# Altium schematic sheet WX0.011.324DL.SchDoc
size A3
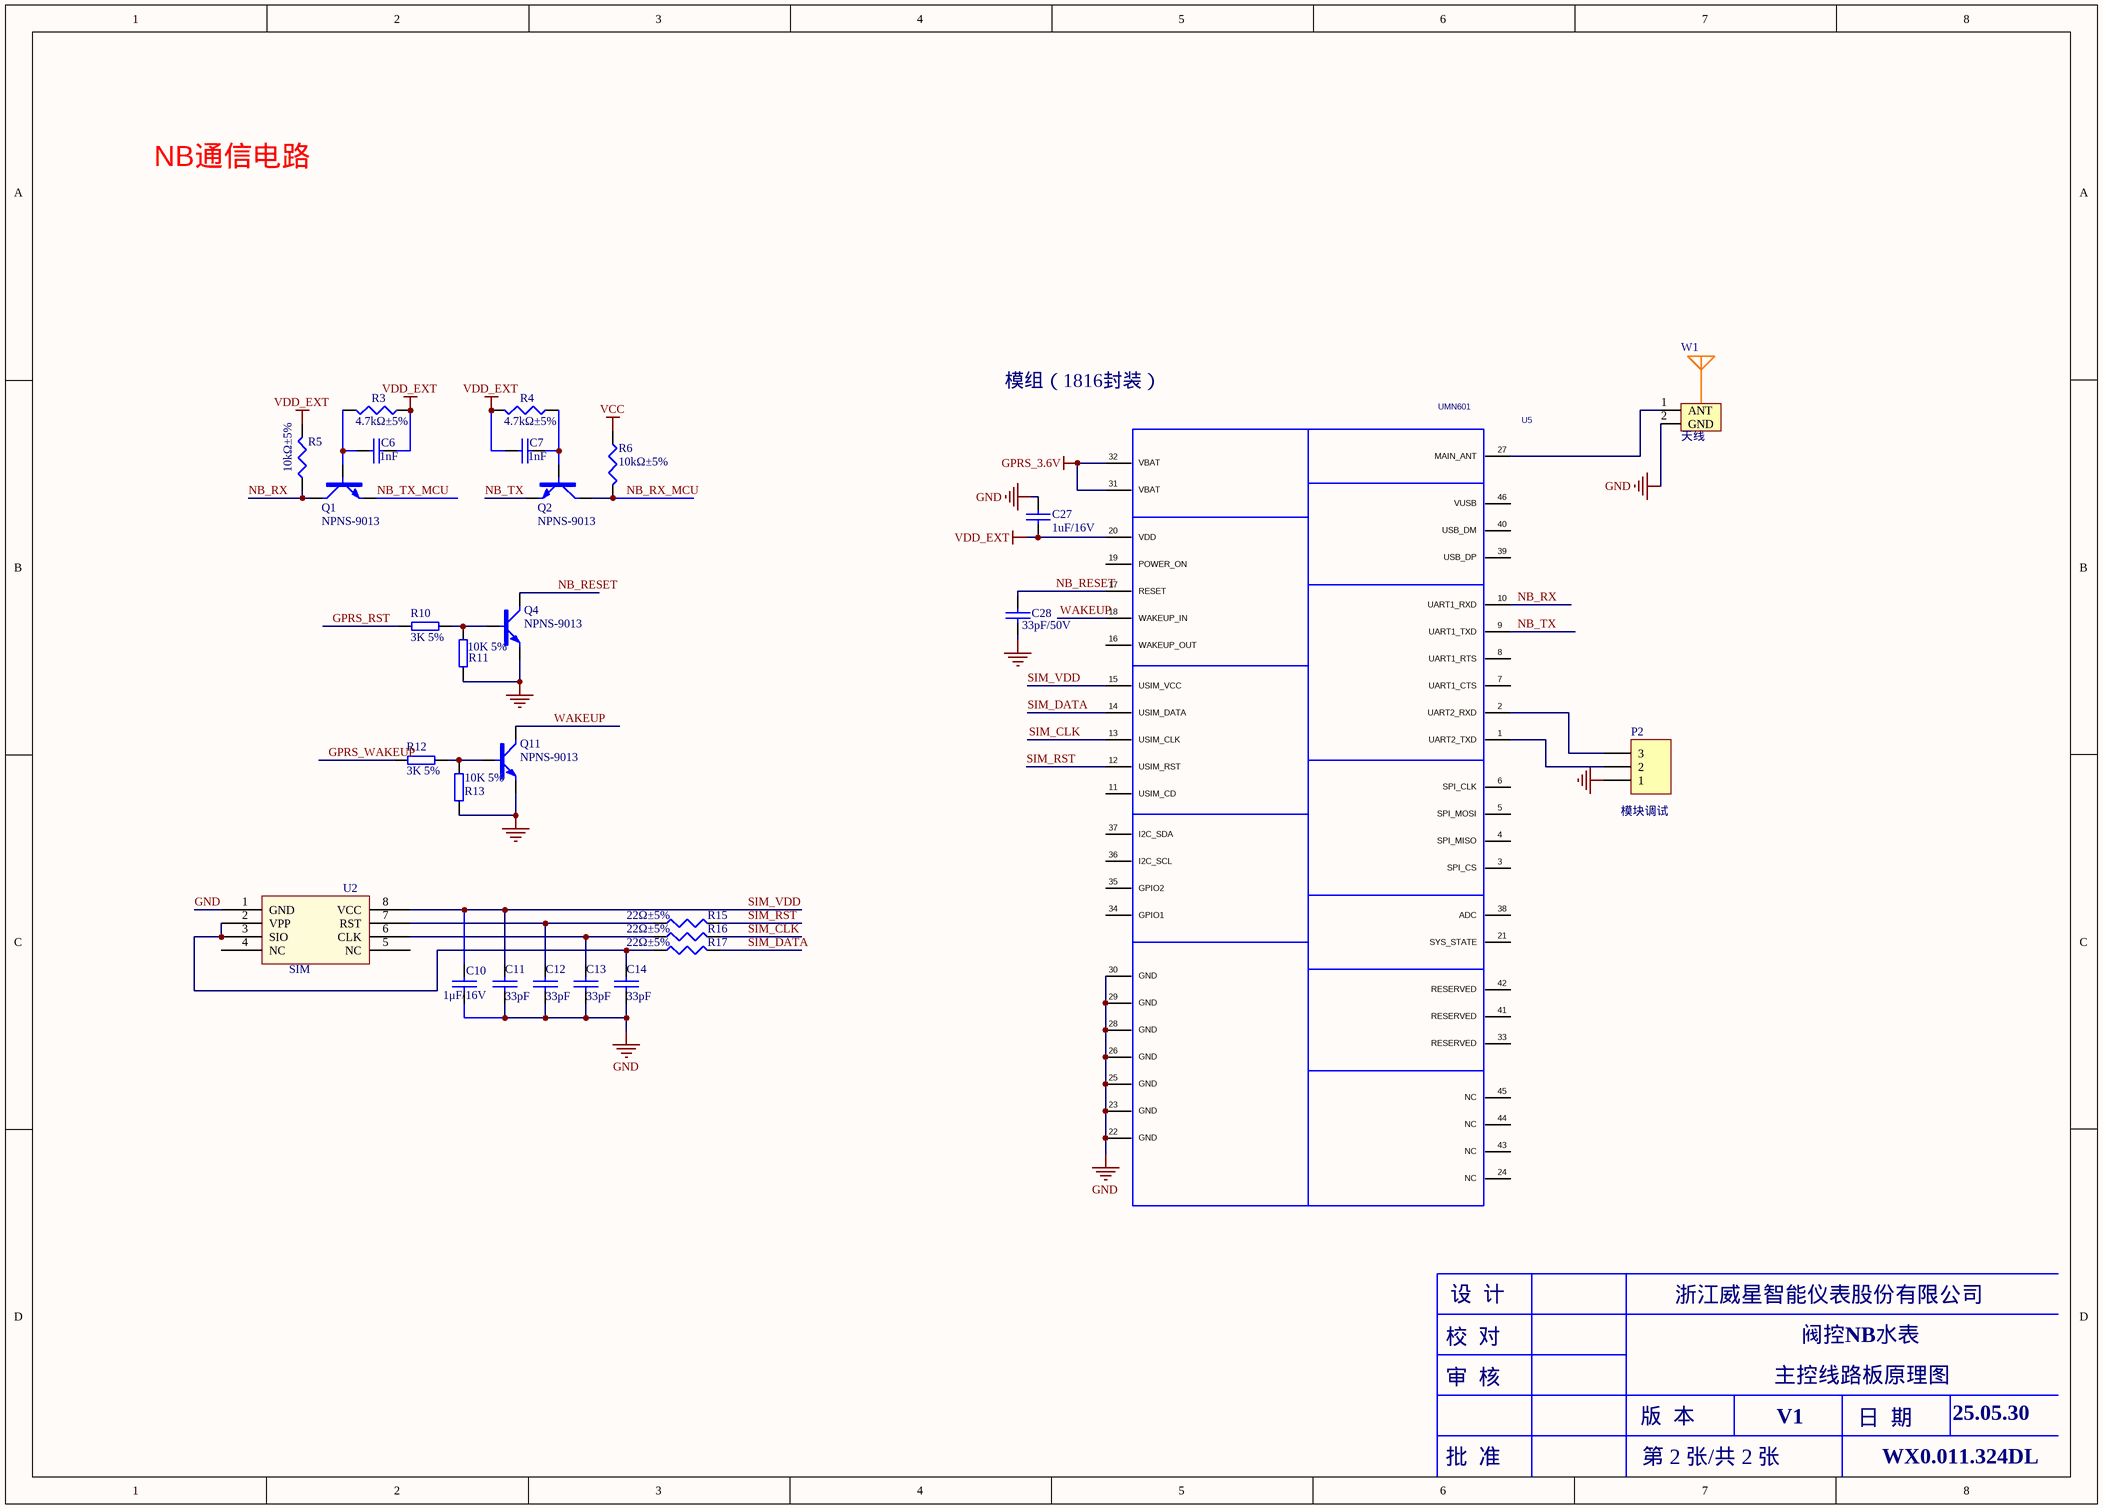
[diagram p0: WX0.011.324DL.SchDoc]

## Parts
C6  1nF  [CAP0603]
C7  1nF  [CAP0603]
C10  1μF/16V  [CAP0603]
C11  33pF  [CAP0603]
C12  33pF  [CAP0603]
C13  33pF  [CAP0603]
C14  33pF  [CAP0603]
C27  1uF/16V  [CAP0603]
C28  33pF/50V  [CAP0603]
P2  模块调试  [PIN254_1*3*WXHJ]
Q1  NPNS-9013  [SOT-23]
Q2  NPNS-9013  [SOT-23]
Q4  NPNS-9013  [SOT-23]
Q11  NPNS-9013  [SOT-23]
R3  4.7kΩ±5%  [RES0603]
R4  4.7kΩ±5%  [RES0603]
R5  10kΩ±5%  [RES0603]
R6  10kΩ±5%  [RES0603]
R10  3K 5%  [RES0603]
R11  10K 5%  [RES0603]
R12  3K 5%  [RES0603]
R13  10K 5%  [RES0603]
R15  22Ω±5%  [RES0603]
R16  22Ω±5%  [RES0603]
R17  22Ω±5%  [RES0603]
U2  SIM  [SIMIC]
U5  UMN601  [N700-FIXTURE_DL_CFT_CQA]
W1  天线  [ANT-tanpian]

## Nets
GND: C10.1 C11.1 C12.1 C13.1 C14.1 C27.2 C28.1 P2.1 Q4.2(E) Q11.2(E) R11.1 R13.1 U2.1(GND) U5.22(GND) U5.23(GND) U5.25(GND) U5.26(GND) U5.28(GND) U5.29(GND) U5.30(GND) W1.2(GND)
GPRS_3.6V: U5.31(VBAT) U5.32(VBAT)
VCC: R6.1
VDD_EXT: C6.2 C7.1 C27.1 R3.1 R4.2 R5.2 U5.20(VDD)
GPRS_RST: R10.1
GPRS_WAKEUP: R12.1
NB_RESET: C28.2 Q4.3(C) U5.17(RESET)
NB_RX: Q1.3(C) R5.1 U5.10(UART1_RXD)
NB_RX_MCU: Q2.3(C) R6.2
NB_TX: Q2.2(E) U5.9(UART1_TXD)
NB_TX_MCU: Q1.2(E)
SIM_CLK: R16.2 U5.13(USIM_CLK)
SIM_DATA: R17.2 U5.14(USIM_DATA)
SIM_RST: R15.2 U5.12(USIM_RST)
SIM_VDD: C10.2 C11.2 U2.8(VCC) U5.15(USIM_VCC)
WAKEUP: Q11.3(C) U5.18(WAKEUP_IN)
NetC6_1: C6.1 Q1.1(B) R3.2
NetC7_2: C7.2 Q2.1(B) R4.1
NetC12_2: C12.2 R15.1 U2.7(RST)
NetC13_2: C13.2 R16.1 U2.6(CLK)
NetC14_2: C14.2 R17.1 U2.2(VPP) U2.3(SIO)
NetP2_2: P2.2 U5.1(UART2_TXD)
NetP2_3: P2.3 U5.2(UART2_RXD)
NetQ4_1: Q4.1(B) R10.2 R11.2
NetQ11_1: Q11.1(B) R12.2 R13.2
NetU5_27: U5.27(MAIN_ANT) W1.1(ANT)

Not connected (* = marked no-connect by the designer): U2 4(NC) 5(NC); U5 3(SPI_CS) 4(SPI_MISO) 5(SPI_MOSI) 6(SPI_CLK) 7(UART1_CTS) 8(UART1_RTS) 11(USIM_CD) 16(WAKEUP_OUT) 19(POWER_ON) 21(SYS_STATE) 24(NC) 33(RESERVED) 34(GPIO1) 35(GPIO2) 36(I2C_SCL) 37(I2C_SDA) 38(ADC) 39(USB_DP) 40(USB_DM) 41(RESERVED) 42(RESERVED) 43(NC) 44(NC) 45(NC) 46(VUSB)

## Notes on the sheet
- NB通信电路
- 模组（1816封装）
- 设  计
- 浙江威星智能仪表股份有限公司
- 审  核
- 校  对
- 主控线路板原理图
- 阀控NB水表
- 版  本
- V1
- 日  期
- 25.05.30
- 批  准
- 第 2 张/共 2 张
- WX0.011.324DL

## Library data of the parts
C6 C7 = 6: 贴片电容,1nF±10%/50V,X7R,国巨; Part Number: 101020103-0022; Manufacturer P/N: CC0603KRX7R9BB102; ID: 6; Part Name: 贴片电容; Manufacturer: 国巨
C10 = 2: 贴片电容,1μF±10%/16V,X7R,国巨; Part Number: 101020103-0003; Manufacturer P/N: CC0603KRX7R7BB105; ID: 2; Part Name: 贴片电容; Manufacturer: 国巨
C11-C14 = 4: 贴片电容,33pF±10%/50V,NP0,国巨; Part Number: 101020103-0027; Manufacturer P/N: CC0603KRNPO9BN33; ID: 4; Part Name: 贴片电容; Manufacturer: 国巨
C27 = 101020103-0003: 105pF,16 V,±10%,0603,国巨,CC0603KRX7R7BB105; Part Name: 0603贴片电容; ID: 14; SMD/DIP: SMD; Part Number: 101020103-0003
C28 = 101020103-0027: 33pF,50 V,±10%,0603,国巨,CC0603KRNPO9BN33; Part Name: 0603贴片电容; ID: 18; SMD/DIP: SMD; Part Number: 101020103-0027
P2 = AD_WXHJ_PinHeader_04: 1*3 ，Φ1.0 ，2.54mm，直脚,无需焊接器件; Part Name: 排针; ID: 27; SMD/DIP: DIP; Part Number: AD_WXHJ_PinHeader_04
Q1 Q2 Q4 Q11 = 101040201-0002: 9013,NPN,SOT-23,长电,S9013; Part Name: 贴片三极管; ID: 14; SMD/DIP: SMD; Part Number: 101040201-0002
R3 R4 = 12: 贴片电阻,4.7kΩ±5%,1/10W,100ppm/℃,国巨; Part Number: 101010103-0042; Manufacturer P/N: RC0603JR-074K7L; ID: 12; Part Name: 贴片电阻; Manufacturer: 国巨
R5 R6 = 2: 贴片电阻,10kΩ±5%,1/10W,100ppm/℃,国巨; Part Number: 101010103-0003; Manufacturer P/N: RC0603JR-0710KL; ID: 2; Part Name: 贴片电阻; Manufacturer: 国巨
R10 R12 = 101010103-0006: 国巨,±5%,0603,,155 ℃,-55 ℃,RC0603JR-073KL,无铅,100 ppm/℃,1/10W,,3K; Part Name: 0603贴片电阻; ID: 22; SMD/DIP: SMD; Part Number: 101010103-0006
R11 R13 = 101010103-0003: 国巨,±5%,0603,,155 ℃,-55 ℃,RC0603JR-0710KL,无铅,200 ppm/℃,1/10W,,10K; Part Name: 0603贴片电阻; ID: 7; SMD/DIP: SMD; Part Number: 101010103-0003
R15-R17 = 14: 贴片电阻,22Ω±5%,1/10W,100ppm/℃,国巨; Part Number: 101010103-0009; Manufacturer P/N: RC0603JR-0722RL; ID: 14; Part Name: 贴片电阻; Manufacturer: 国巨
U2 = 2: 集成电路,ESIM,杭州电信; Part Number: 101050101-0120; Manufacturer: 电信; ID: 2; Part Name: 集成电路
U5 = 1011402-0183: N700-58-01,N700-58-01,通信模块,18.0mm*16.0mm*2.1mm,Band 5:850MHz/Band 8:900MHz,深圳市广和通无线股份有限公司; Part Name: NB-IOT模块; ID: 14; PCB DECAL: N700-FIXTURE_DL_CFT_CQA; Part Number: 1011402-0183
W1 = 1010902-0145: UB06000058A,3*3.1*1.25mm,公头,单排,IPEX一代板端; Part Name: IPEX座; ID: 31; SMD/DIP: SMD; Part Number: 1010902-0145